# EAGLE schematic ECG (EAGLE 9.6.2)
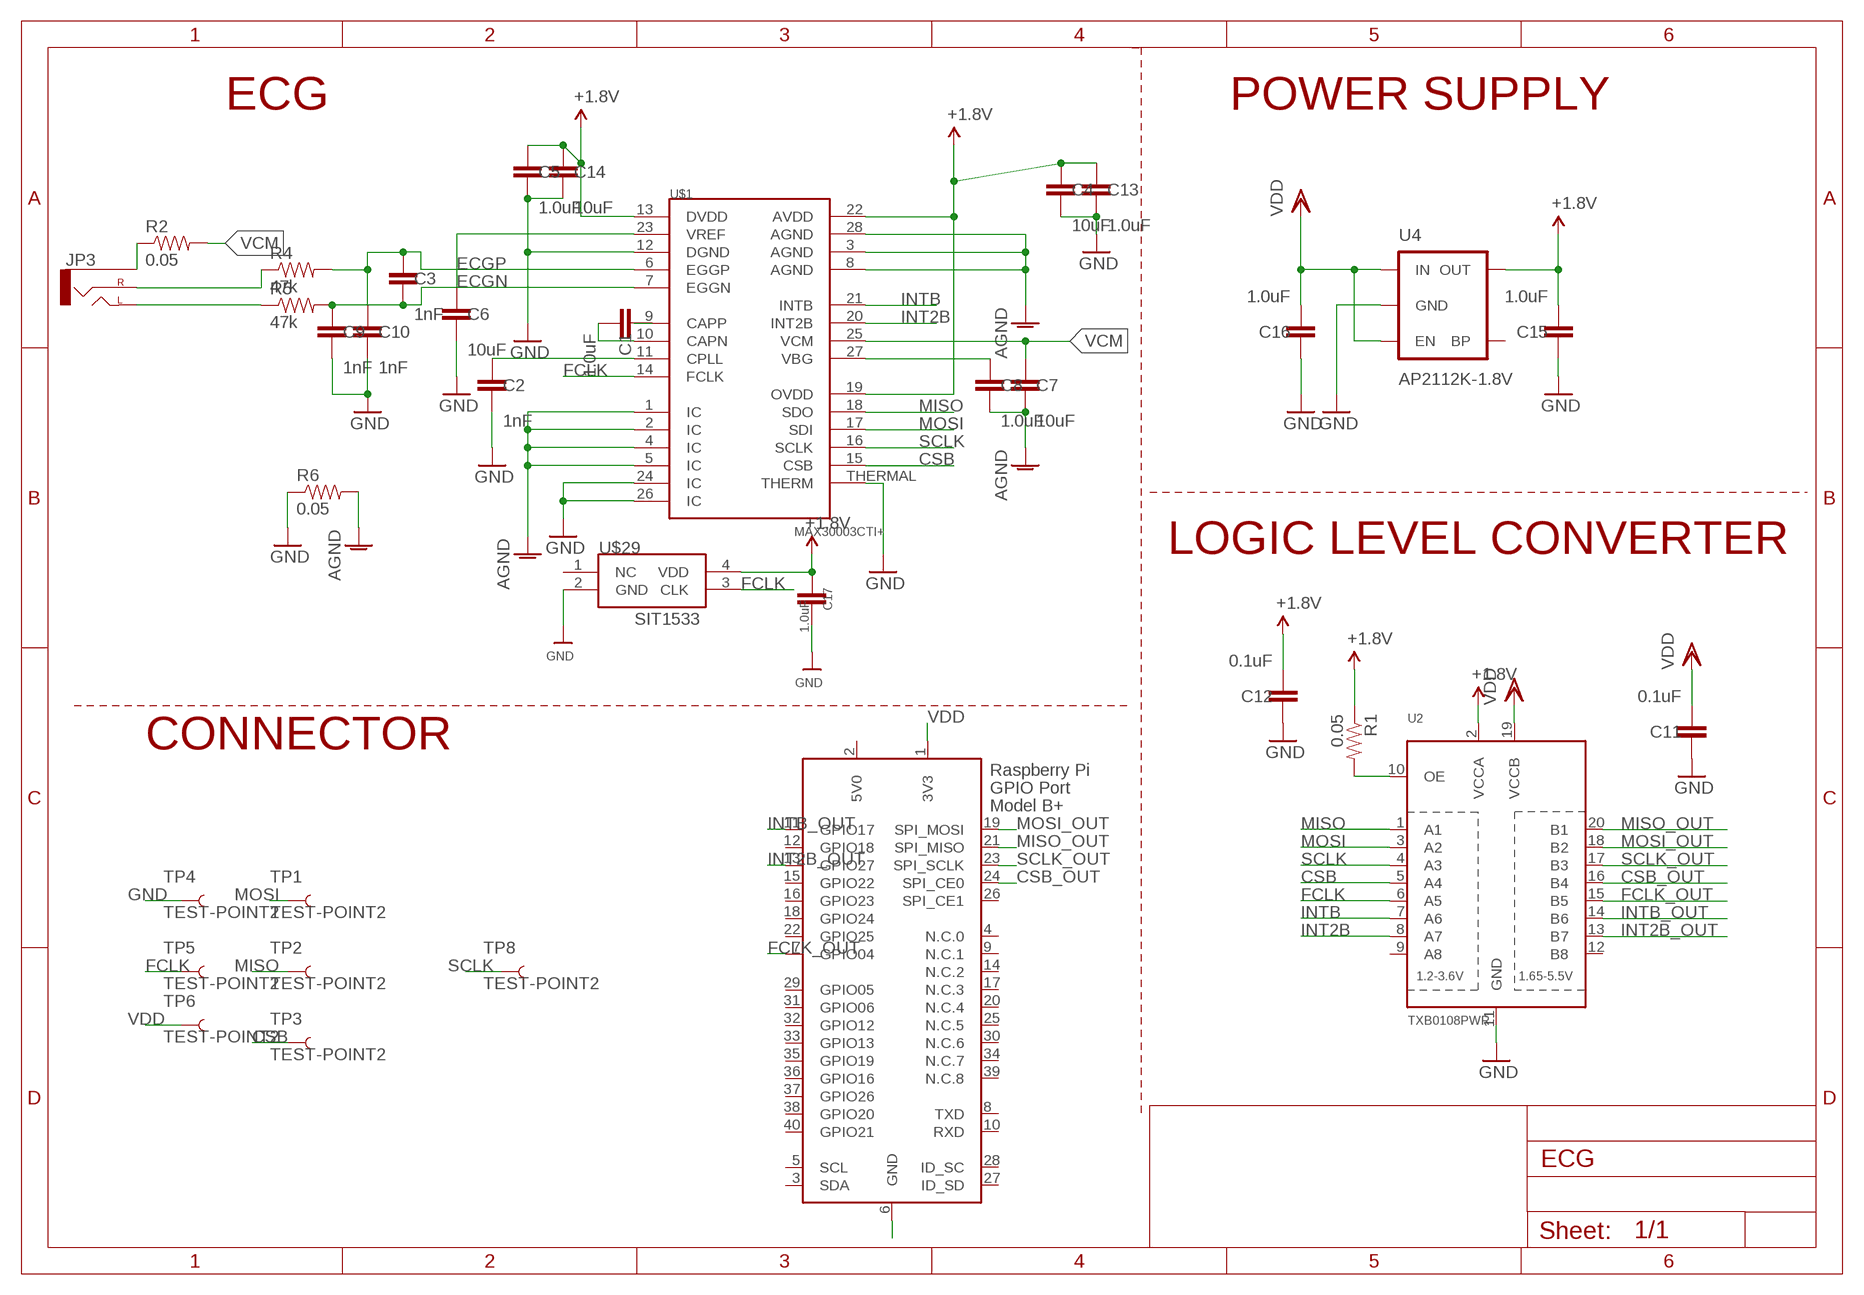
[diagram p0: schematic, sheet 1]

## Parts
C1  1.0uF  1.0UF-0603-16V-10%  [0603]
C2  1nF  1.0NF/1000PF-0603-50V-10%  [0603]
C3  1nF  1.0NF/1000PF-0603-50V-10%  [0603]
C4  10uF  10UF-0603-6.3V-20%  [0603]
C5  1.0uF  1.0UF-0603-16V-10%  [0603]
C6  10uF  10UF-0603-6.3V-20%  [0603]
C7  10uF  10UF-0603-6.3V-20%  [0603]
C8  1.0uF  1.0UF-0603-16V-10%  [0603]
C9  1nF  1.0NF/1000PF-0603-50V-10%  [0603]
C10  1nF  1.0NF/1000PF-0603-50V-10%  [0603]
C11  0.1uF  0.1UF-0603-25V-(+80/-20%)  [0603]
C12  0.1uF  0.1UF-0603-25V-(+80/-20%)  [0603]
C13  1.0uF  1.0UF-0603-16V-10%  [0603]
C14  10uF  10UF-0603-6.3V-20%  [0603]
C15  1.0uF  1.0UF-0603-16V-10%  [0603]
C16  1.0uF  1.0UF-0603-16V-10%  [0603]
C17  1.0uF  1.0UF-0603-16V-10%  [0603]
JP3  AUDIO-JACKSMD2  [AUDIO-JACK-3.5MM-SMD]
R1  0.05  0.05OHM-0603-1/5W-1%  [0603]
R2  0.05  0.05OHM-0603-1/5W-1%  [0603]
R4  47k  47KOHM-0603-1/10W-1%  [0603]
R5  47k  47KOHM-0603-1/10W-1%  [0603]
R6  0.05  0.05OHM-0603-1/5W-1%  [0603]
TP1  TEST-POINT2  [PAD.02X.02]
TP2  TEST-POINT2  [PAD.02X.02]
TP3  TEST-POINT2  [PAD.02X.02]
TP4  TEST-POINT2  [PAD.02X.02]
TP5  TEST-POINT2  [PAD.02X.02]
TP6  TEST-POINT2  [PAD.02X.02]
TP8  TEST-POINT2  [PAD.02X.02]
U2  TXB0108PWR  [TSSOP20]
U4  AP2112K-1.8V  V_REG_LDOSMD  [SOT23-5]
U$1  MAX30003CTI+  MAX30003  [QFN-28]
U$29  SIT1533  [SIT1533]
X1  RASPI_BOARD_B+_HDC  [RASPI_BOARD_B+HAT_DF_CF]

## Nets
+1.8V: C4.1 C5.1 C12.2 C13.1 C14.1 C15.2 C17.1 R1.1 U2.2(VCCA) U4.5(OUT) U$1.13(DVDD) U$1.19(OVDD) U$1.22(AVDD) U$29.4(VDD)
AGND: C7.2 C8.2 R6.2 U$1.1(IC) U$1.2(IC) U$1.3(AGND) U$1.4(IC) U$1.5(IC) U$1.8(AGND) U$1.28(AGND)
CSB: TP3.P$1 U2.5(A4) U$1.15(CSB)
CSB_OUT: U2.16(B4) X1.24(SPI_CE0)
ECGN: C3.2 C9.1 R5.2 U$1.7(EGGN)
ECGP: C3.1 C10.1 R4.2 U$1.6(EGGP)
FCLK: TP5.P$1 U2.6(A5) U$1.14(FCLK) U$29.3(CLK)
FCLK_OUT: U2.15(B5) X1.7(GPIO04)
GND: C2.2 C4.2 C5.2 C6.2 C9.2 C10.2 C11.1 C12.1 C13.2 C14.2 C15.1 C16.1 C17.2 R6.1 TP4.P$1 U2.11(GND) U4.2(GND) U$1.12(DGND) U$1.24(IC) U$1.26(IC) U$1.THERMAL(THERM) U$29.2(GND)
INT2B: U2.8(A7) U$1.20(INT2B)
INT2B_OUT: U2.13(B7) X1.13(GPIO27)
INTB: U2.7(A6) U$1.21(INTB)
INTB_OUT: U2.14(B6) X1.11(GPIO17)
MISO: TP2.P$1 U2.1(A1) U$1.18(SDO)
MISO_OUT: U2.20(B1) X1.21(SPI_MISO)
MOSI: TP1.P$1 U2.3(A2) U$1.17(SDI)
MOSI_OUT: U2.18(B2) X1.19(SPI_MOSI)
N$1: R1.2 U2.10(OE)
N$2: C6.1 U$1.23(VREF)
N$3: C1.1 U$1.9(CAPP)
N$4: JP3.SLEEVE R2.1
N$5: X1.6(GND)
N$6: C1.2 U$1.10(CAPN)
N$7: C2.1 U$1.11(CPLL)
N$9: JP3.TIP(LEFT) R5.1
N$10: JP3.RING(RIGHT) R4.1
N$14: C8.1 U$1.27(VBG)
SCLK: TP8.P$1 U2.4(A3) U$1.16(SCLK)
SCLK_OUT: U2.17(B3) X1.23(SPI_SCLK)
VCM: C7.1 R2.2 U$1.25(VCM)
VDD: C11.2 C16.2 TP6.P$1 U2.19(VCCB) U4.1(IN) U4.3(EN) X1.1(3V3)
Unconnected: U2.9(A8) U2.12(B8) U4.4(BP) U$29.1(NC) X1.3(SDA) X1.4(N.C.0) X1.5(SCL) X1.8(TXD) X1.9(N.C.1) X1.10(RXD) X1.12(GPIO18) X1.14(N.C.2) X1.15(GPIO22) X1.16(GPIO23) X1.17(N.C.3) X1.18(GPIO24) X1.20(N.C.4) X1.22(GPIO25) X1.25(N.C.5) X1.26(SPI_CE1) X1.27(ID_SD) X1.28(ID_SC) X1.29(GPIO05) X1.30(N.C.6) X1.31(GPIO06) X1.32(GPIO12) X1.33(GPIO13) X1.34(N.C.7) X1.35(GPIO19) X1.36(GPIO16) X1.37(GPIO26) X1.38(GPIO20) X1.39(N.C.8) X1.40(GPIO21)

## Notes on the sheet
- ECG | POWER SUPPLY
- LOGIC LEVEL CONVERTER
- CONNECTOR

## Power pins joined to a net without a drawn wire
5V0: X1.2(5V0)

## Library data of the parts
C1 C5 C8 C13 C15-C17 = SparkFun-Capacitors:1.0UF: 1µF ceramic capacitors A capacitor is a passive two-terminal electrical component used to store electrical energy temporarily in an electric field.; PROD_ID: CAP-00868
C2 C3 C9 C10 = SparkFun-Capacitors:1.0NF/1000PF: 1nF/1,000pF ceramic capacitors A capacitor is a passive two-terminal electrical component used to store electrical energy temporarily in an electric field.; PROD_ID: CAP-07886
C4 C6 C7 C14 = SparkFun-Capacitors:10UF: 10.0µF ceramic capacitors A capacitor is a passive two-terminal electrical component used to store electrical energy temporarily in an electric field.; PROD_ID: CAP-11015
C11 C12 = SparkFun-Capacitors:0.1UF: 0.1µF ceramic capacitors A capacitor is a passive two-terminal electrical component used to store electrical energy temporarily in an electric field.; PROD_ID: CAP-00810
JP3 = SparkFun-Connectors:AUDIO-JACK: 3.5mm Audio Jack Simple 3.5mm common PCB mount audio jack. SKU: PRT-08032; PROD_ID: CONN-10353
R1 R2 R6 = SparkFun-Resistors:0.05OHM: 0.05Ω resistor A resistor is a passive two-terminal electrical component that implements electrical resistance as a circuit element. Resistors act to reduce current flow, and, at the same time, act to lower voltage levels within circuits. - Wikipedia; PROD_ID: RES-12535
R4 R5 = SparkFun-Resistors:47KOHM: 47kΩ resistor A resistor is a passive two-terminal electrical component that implements electrical resistance as a circuit element. Resistors act to reduce current flow, and, at the same time, act to lower voltage levels within circuits. - Wikipedia; PROD_ID: RES-07871
TP1-TP6 TP8 = SparkFun-Connectors:TEST-POINT: SparkFun Test Points Bare copper test points for troubleshooting or In-Circuit-Testing. These are used by our Production team for verifying production board runs using pogo-pins on test beds. SparkFun Products: SparkFun LSM9DS1 Breakout <https://www.sparkfun.com/products/13284> SparkFun PSOC <https://www.sparkfun.com/products/13714> SparkFun Load Cell Amplifier <https://www.sparkfun.com/products/13879>
U2 = adafruit:TXB0108PWR: 8-Bit Bi-Directional Level Shifter 1.2V-3.6V (VCCA) to 1.65V-5.5V (VCCB) bi-directional level shifter with auto direction sensing. Max data rate - VCCA 1.8V: 20Mbps (50ns), VCCA 3.3V: 100Mbps (10ns) Digikey: 296-21527-1-ND
U4 = SparkFun-PowerIC:V_REG_LDO: Voltage Regulator LDO Standard 150mA LDO voltage regulator in SOT-23 layout. Micrel part MIC5205. BP (by-pass) pin is used to lower output noise with 470pF cap.; PROD_ID: VREG-12457
U$1 = circuitects:MAX30003
U$29 = circuitects:SIT1533
X1 = raspberrypi_bastelstube_v13:RASPI_BOARD_B+: Raspberry Pi GPIO connector with markings for the outer dimensions of the Raspberry Pi board model B+ with different sets of drill holes or mounting pads